# EasyEDA Pro project miniMQ.epro, board Encoder
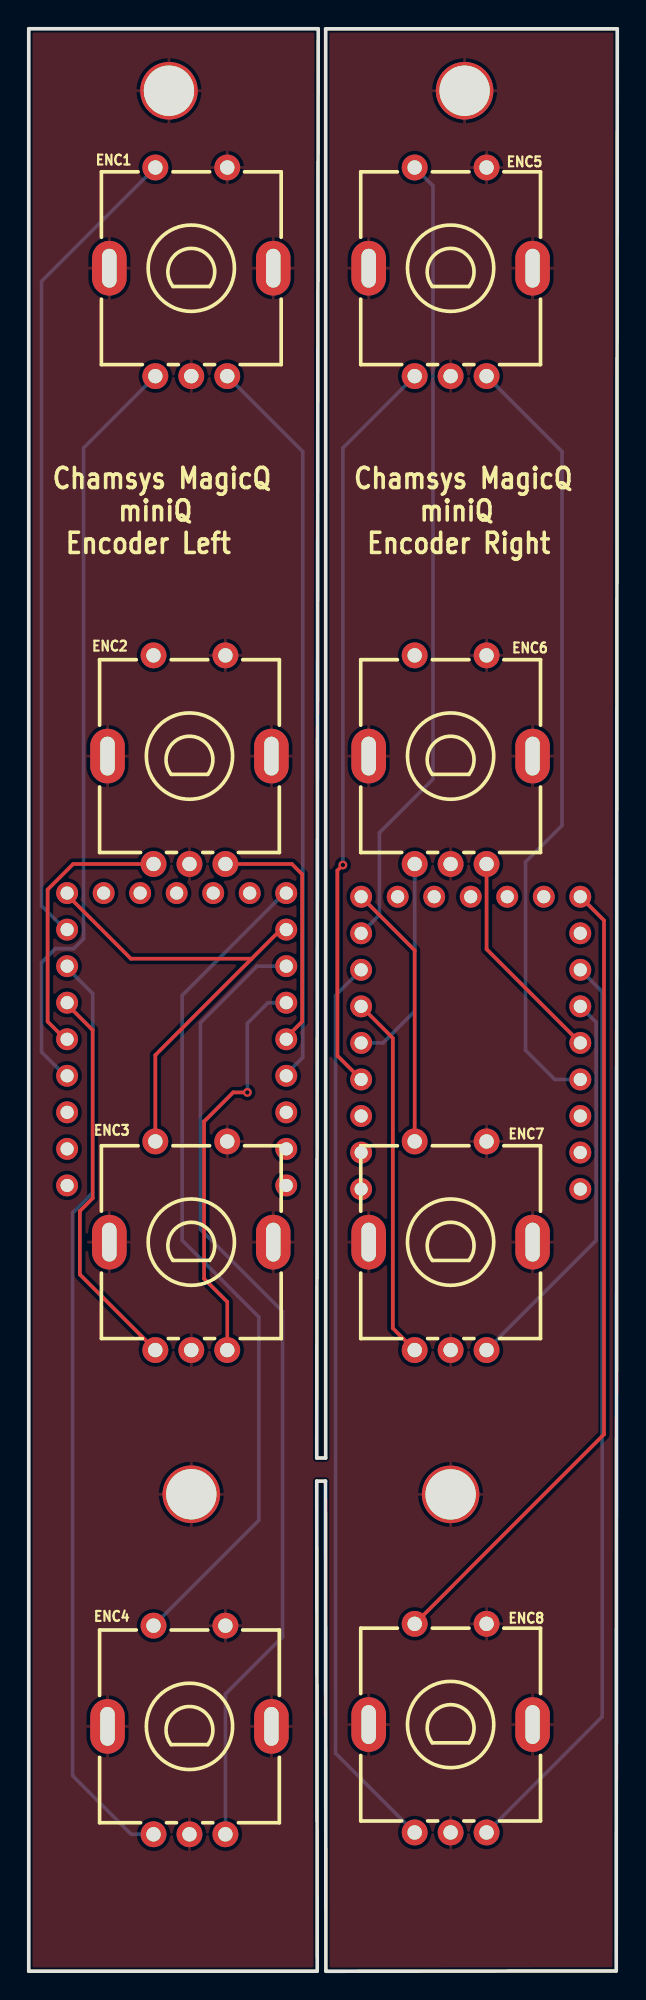
[diagram p9: board, top side]
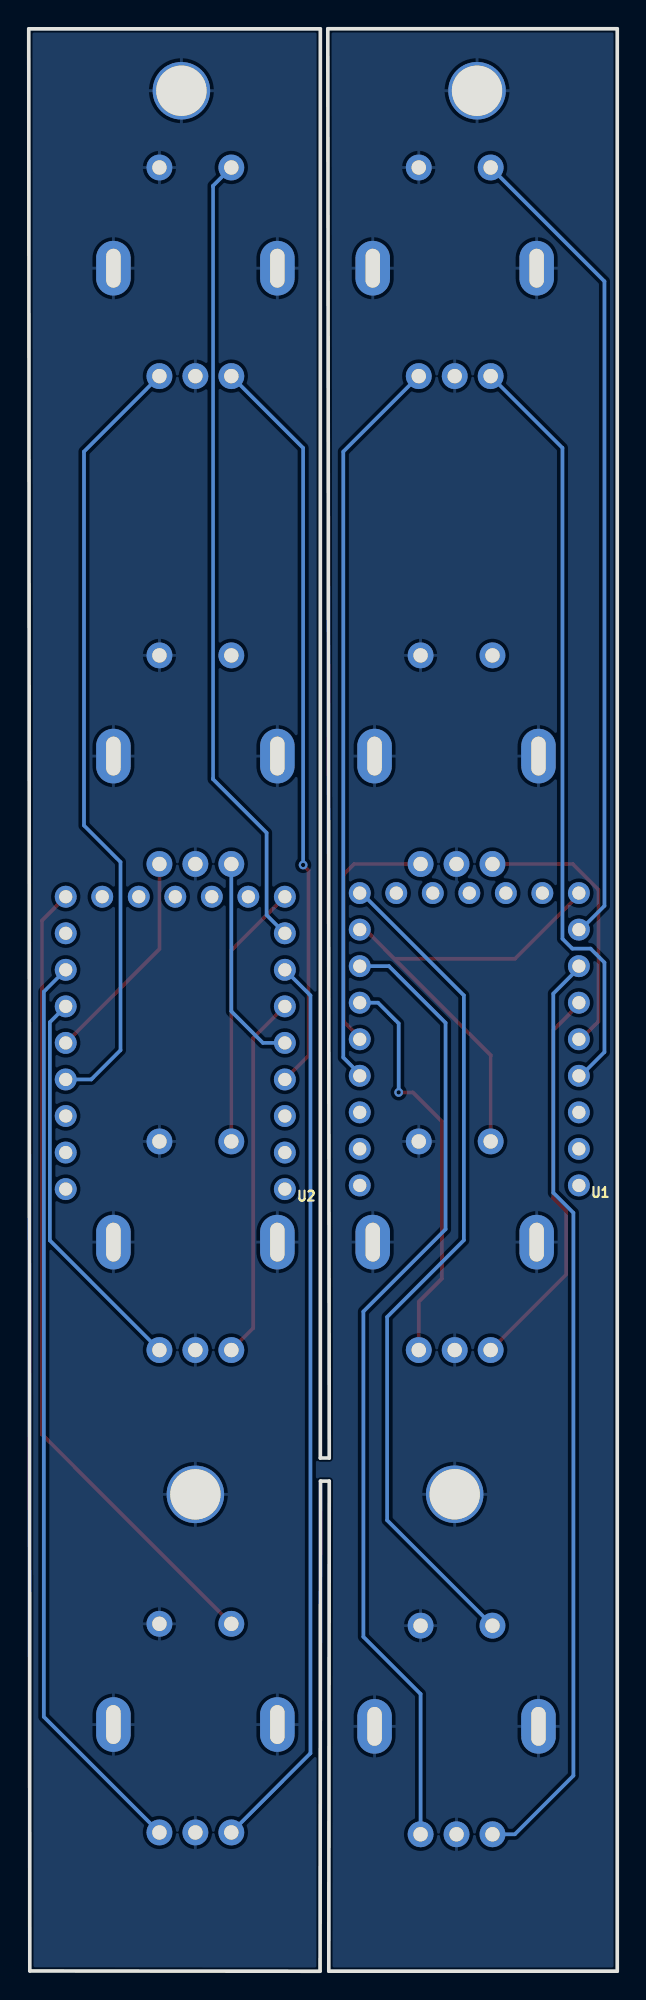
[diagram p10: board, bottom side, seen from below]

Outline 40.92 x 135 mm; copper layers: Top Layer, Bottom Layer. Coordinates in mm from the lower left corner of the outline.
Outline path: 0,135 0,0 20.06,0 20.03,34.06 20.63,34.06 20.67,0 40.85,0.02 40.92,135 20.65,135 20.65,35.67 20.03,35.67 20.13,135 0,135
Stack: Top Layer 0.035mm / Dielectric1 1.51mm FR4 er 4.5 / Bottom Layer 0.035mm

## Design rules (mm)
template: JLCPCB Capability(Two Layers Board)
spacing copperThickness1oz (default): track to track 0.102, other pairs 0.152 to 0.3
spacing copperThickness2oz: track to track 0.203, other pairs 0.152 to 0.3
track width copperThickness1oz (default): min 0.127, default 0.254, max 2.54
track width copperThickness2oz: min 0.203, default 0.254, max 2.54
differential pair differentialPair (default): width min 0.127, default 0.254, max 2.54; gap min 0.152, default 0.152
via viaSize (default): diameter min 0.5, default 0.61, max 10; hole min 0.3, default 0.305, max 6.3

## Placement (name value [footprint] x y rotation side)
ENC1  PEC11R-4015F-S0024  [SW-TH_PEC11R-4XXXF-SXXXX]  11.3 118.11 0 top
ENC2  PEC11R-4015F-S0024  [SW-TH_PEC11R-4XXXF-SXXXX]  11.18 84.21 0 top
ENC3  PEC11R-4015F-S0024  [SW-TH_PEC11R-4XXXF-SXXXX]  11.3 50.42 0 top
ENC4  PEC11R-4015F-S0024  [SW-TH_PEC11R-4XXXF-SXXXX]  11.18 16.77 0 top
ENC5  PEC11R-4015F-S0024  [SW-TH_PEC11R-4XXXF-SXXXX]  29.34 118.11 0 top
ENC6  PEC11R-4015F-S0024  [SW-TH_PEC11R-4XXXF-SXXXX]  29.34 84.21 0 top
ENC7  PEC11R-4015F-S0024  [SW-TH_PEC11R-4XXXF-SXXXX]  29.34 50.42 0 top
ENC8  PEC11R-4015F-S0024  [SW-TH_PEC11R-4XXXF-SXXXX]  29.34 16.9 0 top
NOREF  -  [Pad_e4668]  30.31 130.7 0 top
NOREF#2  -  [Pad_e4670]  11.3 33.15 0 top
NOREF#3  -  [Pad_e4667]  9.75 130.7 0 top
NOREF#4  -  [Pad_e4669]  29.34 33.14 0 top
U1  RP2040ZeroWS  [RP2040]  10.29 74.93 0 bottom
U2  RP2040ZeroWS  [RP2040]  30.73 74.68 0 bottom

## Footprints (pads in the part's own frame, mm; a bottom-side part is the same pattern mirrored in y, then rotated)
Pad_e4667
  round 4 hole 3.5: 1(0,0)
Pad_e4668
  round 4 hole 3.5: 1(0,0)
Pad_e4669
  round 4 hole 3.5: 1(0,0)
Pad_e4670
  round 4 hole 3.5: 1(0,0)
RP2040
  round 1.524 hole 0.914: 1(-7.62,20.32) 2(-7.62,17.78) 3(-7.62,15.24) 4(-7.62,12.7) 5(-7.62,10.16) 6(-7.62,7.62) 7(-7.62,5.08) 8(-7.62,2.54) 9(-7.62,0) 10(-5.08,0) 11(-2.54,0) 12(0,0) 13(2.54,0) 14(5.08,0) 15(7.62,0) 16(7.62,2.54) 17(7.62,5.08) 18(7.62,7.62) 19(7.62,10.16) 20(7.62,12.7) 21(7.62,15.24) 22(7.62,17.78) 23(7.62,20.32)
SW-TH_PEC11R-4XXXF-SXXXX
  round 1.8 hole 1: 1(-2.5,7.25) 2(2.5,7.25) A(-2.5,-7.25) B(2.5,-7.25) C(0,-7.25)
  oval 2.4x3.8 hole 1x2.7: MT1(-5.7,0.25) MT2(5.7,0.25)

## Nets
As in the schematic, except:
GND: ENC1.2 ENC1.C ENC1.MT1 ENC1.MT2 ENC2.2 ENC2.C ENC2.MT1 ENC2.MT2 ENC3.2 ENC3.C ENC3.MT1 ENC3.MT2 ENC4.2 ENC4.C ENC4.MT1 ENC4.MT2 ENC5.2 ENC5.C ENC5.MT1 ENC5.MT2 ENC6.2 ENC6.C ENC6.MT1 ENC6.MT2 ENC7.2 ENC7.C ENC7.MT1 ENC7.MT2 ENC8.2 ENC8.C ENC8.MT1 ENC8.MT2 NOREF.1 NOREF#2.1 NOREF#3.1 NOREF#4.1

Pads without a net: ENC6 1; U1 1 2 3 10 11 12 13 14 21 22 23; U2 1 2 3 10 11 12 13 14 21 22 23

## Via types
v1: diameter 0.61, hole 0.305, Top Layer to Bottom Layer, 2 vias

## Routing (per net, layer and track width the routed paths; a pad name or vN(x,y) marks a point on that pad's centre or on a via; arc(x,y) is an arc through that point)
ENC-A-1: length 53.3
  Bottom Layer w0.254: 2.54,62.23 0.89,63.89 0.89,70.11 1.85,71.07 3.12,71.07 3.81,71.76 3.81,105.87 ENC1.A
ENC-A-2: length 19
  Top Layer w0.254: 2.54,64.77 1.31,66 1.31,75.18 3.09,76.96 ENC2.A
ENC-A-3: length 27.5
  Top Layer w0.254: 2.54,67.31 4.44,65.41 4.44,53.73 3.56,52.84 3.56,48.42 ENC3.A
ENC-A-4: length 64.9
  Bottom Layer w0.254: 2.54,69.85 4.44,67.95 4.44,54.11 3.05,52.71 3.05,13.59 7.12,9.52 ENC4.A
ENC-A-5: length 51.8
  Top Layer w0.254: v1(21.84,76.89) 21.46,76.51 21.46,63.63 U2.4
  Bottom Layer w0.254: ENC5.A 21.84,105.87 v1(21.84,76.89)
ENC-A-6: length 14.9
  Bottom Layer w0.254: U2.5 24.64,64.52 26.84,66.72 ENC6.A
ENC-A-7: length 25.4
  Top Layer w0.254: ENC7.A 25.31,44.7 25.31,64.86 U2.6
ENC-A-8: length 63
  Bottom Layer w0.254: ENC8.A 21.34,15.15 21.34,67.82 U2.7
ENC-B-1: length 51.3
  Bottom Layer w0.254: ENC1.B 19.05,105.62 19.05,63.5 17.78,62.23
ENC-B-2: length 17.6
  Top Layer w0.254: ENC2.B 18.3,76.96 19.01,76.24 19.01,66 17.78,64.77
ENC-B-3: length 28.4
  Top Layer w0.254: ENC3.B 13.8,46.53 12.19,48.14 12.19,59.06 14.21,61.08 v1(15.2,61.08)
  Bottom Layer w0.254: 17.78,67.31 16.64,67.31 15.2,65.88 v1(15.2,61.08)
ENC-B-4: length 67.9
  Bottom Layer w0.254: 17.78,69.85 15.88,69.85 11.94,65.92 11.94,51.57 17.65,45.85 17.65,23.25 13.68,19.27 ENC4.B
ENC-B-5: length 54.7
  Bottom Layer w0.254: ENC5.B 37.08,105.62 37.08,79.63 34.54,77.09 34.54,64.01 36.58,61.98 38.35,61.98
ENC-B-6: length 15.1
  Top Layer w0.254: 38.35,64.52 31.84,71.04 ENC6.B
ENC-B-7: length 27.5
  Bottom Layer w0.254: 38.35,67.06 39.46,65.96 39.46,50.79 ENC7.B
ENC-B-8: length 63.9
  Bottom Layer w0.254: 38.35,69.6 39.88,68.08 39.88,17.69 ENC8.B
ENC-SW-1: length 56.9
  Bottom Layer w0.254: 2.54,72.39 0.89,74.05 0.89,117.45 ENC1.1
ENC-SW-3: length 33.4
  Top Layer w0.254: 15.5,70.37 17.53,72.39 17.78,72.39 ; 15.5,70.37 7.1,70.37 2.54,74.93 ; 15.5,70.37 8.8,63.67 ENC3.1
ENC-SW-4: length 59.1
  Bottom Layer w0.254: ENC4.1 16,31.34 16,45.47 10.67,50.8 10.67,67.82 17.78,74.93
ENC-SW-5: length 55.8
  Bottom Layer w0.254: U2.8 24.38,73.41 24.38,79.13 28.11,82.85 28.11,124.09 ENC5.1
ENC-SW-7: length 18.5
  Top Layer w0.254: ENC7.1 26.84,70.96 U2.9
ENC-SW-8: length 56.7
  Top Layer w0.254: ENC8.1 40,37.31 40,73.03 38.35,74.68

## Copper pours and planes (outline as drawn; the poured copper is in the pictures)
GND on Top Layer: -4.83,137.93 46.23,137.93 46.23,-2.28 -4.83,-2.28
GND on Bottom Layer: -3.94,136.78 47.37,136.78 47.37,-3.93 -3.94,-3.93

## Text on the board
Top Silkscreen Layer: Chamsys MagicQ / miniQ / Encoder Left | Chamsys MagicQ / miniQ / Encoder Right
